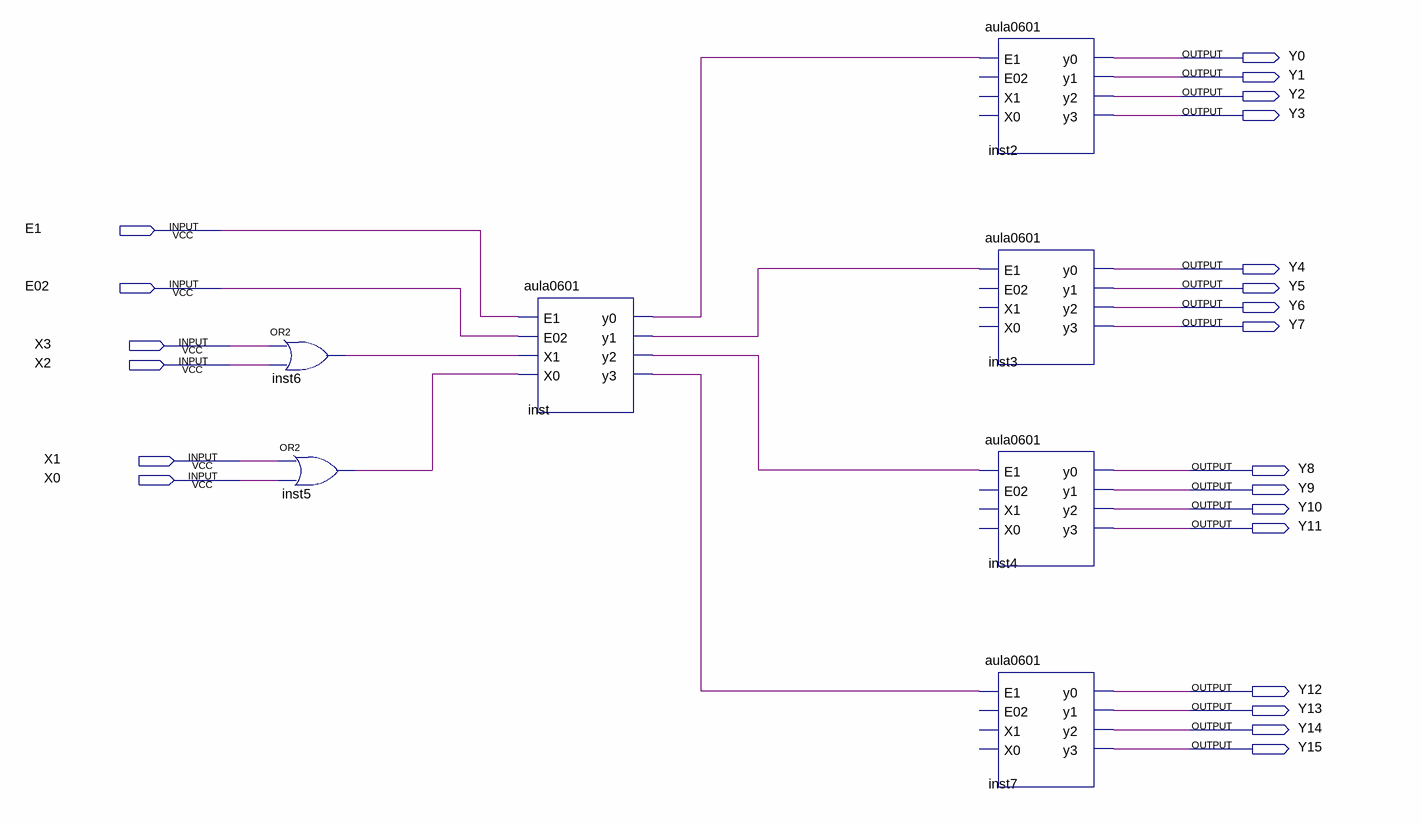
[diagram p0: schematic sheet]
// Quartus schematic DecoderDemo.bdf as structural Verilog: 7 symbols, 22 pins
module DecoderDemo (
  input  E1,
  input  E02,
  input  X3,
  input  X2,
  input  X1,
  input  X0,
  output Y0,
  output Y1,
  output Y2,
  output Y3,
  output Y4,
  output Y5,
  output Y6,
  output Y7,
  output Y8,
  output Y9,
  output Y10,
  output Y11,
  output Y12,
  output Y13,
  output Y14,
  output Y15
);

  wire inst5_out, inst6_out, inst_y0, inst_y1, inst_y2, inst_y3;

  or inst6 (inst6_out, X3, X2);
  or inst5 (inst5_out, X1, X0);
  aula0601 inst (
    .E1(E1), .E02(E02), .X1(inst6_out), .X0(inst5_out), .y0(inst_y0), .y1(inst_y1), .y2(inst_y2), .y3(inst_y3));
  aula0601 inst2 (.E1(inst_y0), .y0(Y0), .y1(Y1), .y2(Y2), .y3(Y3));  // open: E02, X1, X0
  aula0601 inst3 (.E1(inst_y1), .y0(Y4), .y1(Y5), .y2(Y6), .y3(Y7));  // open: E02, X1, X0
  aula0601 inst4 (.E1(inst_y2), .y0(Y8), .y1(Y9), .y2(Y10), .y3(Y11));  // open: E02, X1, X0
  aula0601 inst7 (.E1(inst_y3), .y0(Y12), .y1(Y13), .y2(Y14), .y3(Y15));  // open: E02, X1, X0
endmodule
